# Altium schematic sheet MosfetDrivers.SchDoc
size 420 x 297 mm; Author: Denizhan ALTAY; SheetNumber: 4; SheetTotal: 6
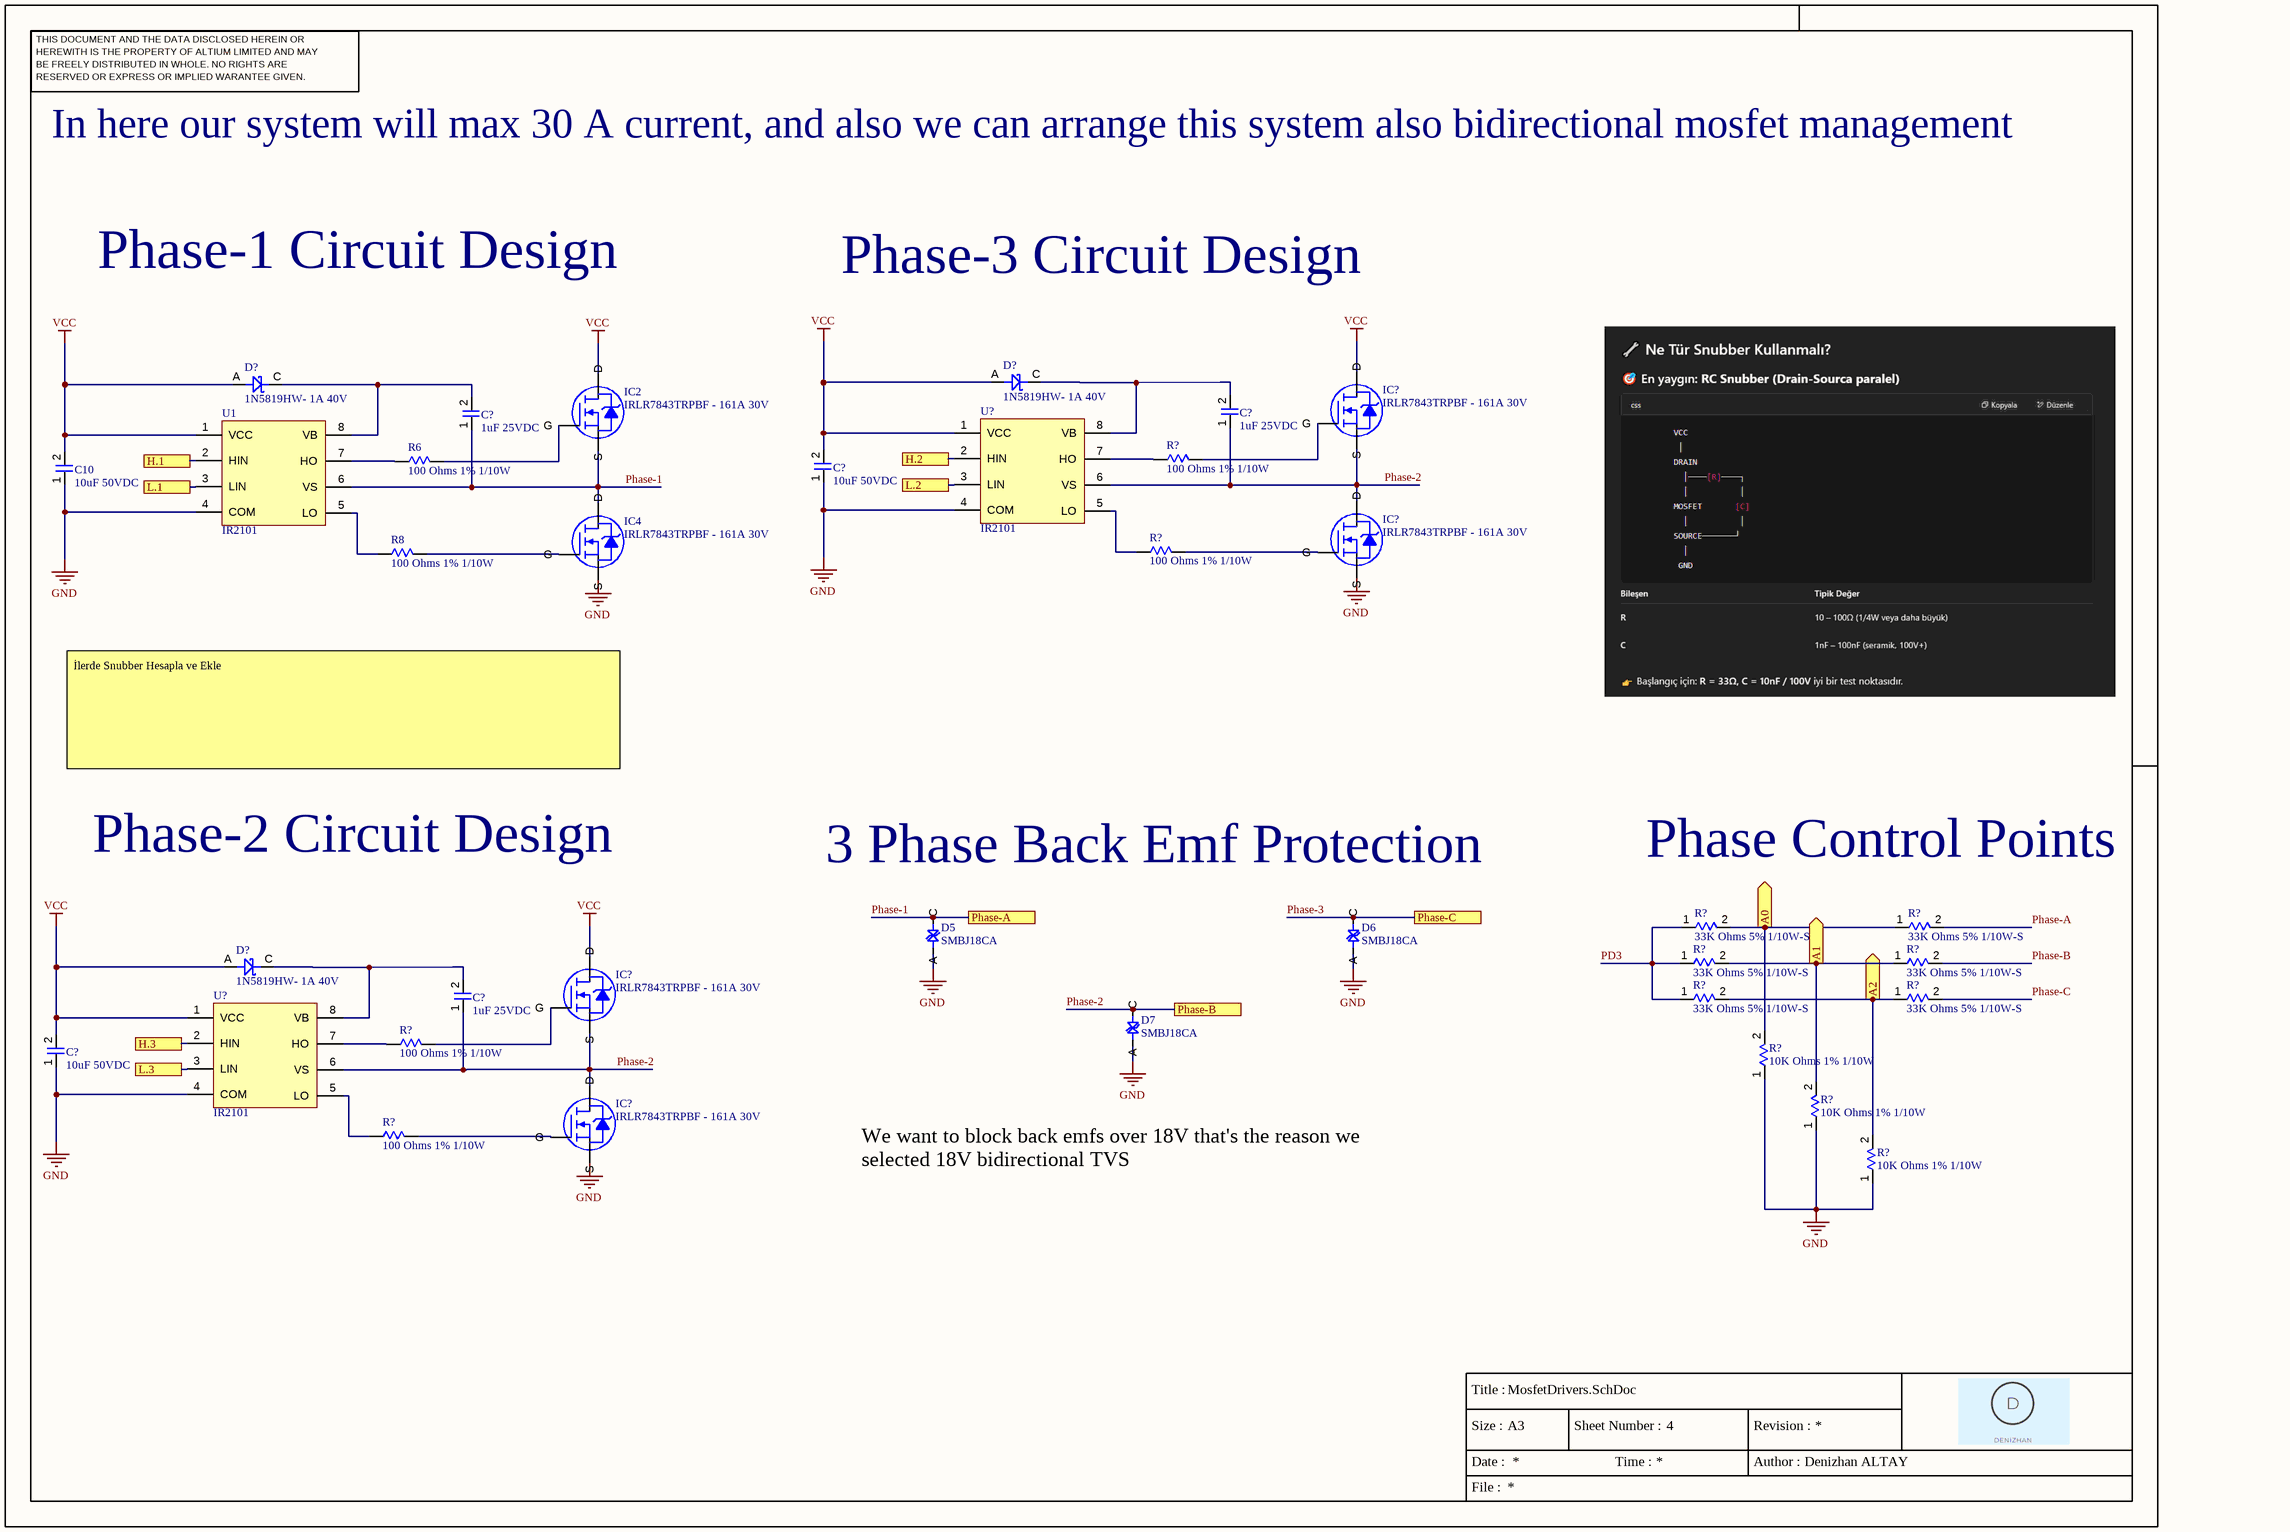
[diagram p0: MosfetDrivers.SchDoc]

## Parts
(Parts that share a designator on the sheet are numbered #1, #2 ... from top to bottom, then left to right.)
C10  10uF 50VDC  [0805_Capacitor_Special_CC0805KKX7R9BB106]
C?#1  1uF 25VDC  [0603_UnP_Capacitor]
C?#2  1uF 25VDC  [0603_UnP_Capacitor]
C?#3  10uF 50VDC  [0805_Capacitor_Special_CC0805KKX7R9BB106]
C?#4  1uF 25VDC  [0603_UnP_Capacitor]
C?#5  10uF 50VDC  [0805_Capacitor_Special_CC0805KKX7R9BB106]
D5  SMBJ18CA  [SMBJ18CA-TKS]
D6  SMBJ18CA  [SMBJ18CA-TKS]
D7  SMBJ18CA  [SMBJ18CA-TKS]
D?#1  1N5819HW- 1A 40V  [1N5819HW-7-F]
D?#2  1N5819HW- 1A 40V  [1N5819HW-7-F]
D?#3  1N5819HW- 1A 40V  [1N5819HW-7-F]
IC2  IRLR7843TRPBF - 161A 30V  [IRLR7843_DPAK229P991X239-3N]
IC4  IRLR7843TRPBF - 161A 30V  [IRLR7843_DPAK229P991X239-3N]
IC?#1  IRLR7843TRPBF - 161A 30V  [IRLR7843_DPAK229P991X239-3N]
IC?#2  IRLR7843TRPBF - 161A 30V  [IRLR7843_DPAK229P991X239-3N]
IC?#3  IRLR7843TRPBF - 161A 30V  [IRLR7843_DPAK229P991X239-3N]
IC?#4  IRLR7843TRPBF - 161A 30V  [IRLR7843_DPAK229P991X239-3N]
R6  100 Ohms 1% 1/10W  [0603_Resistor_Case]
R8  100 Ohms 1% 1/10W  [0603_Resistor_Case]
R?#1  100 Ohms 1% 1/10W  [0603_Resistor_Case]
R?#2  100 Ohms 1% 1/10W  [0603_Resistor_Case]
R?#3  33K Ohms 5% 1/10W-S  [0603_Resistor_Case]
R?#4  33K Ohms 5% 1/10W-S  [0603_Resistor_Case]
R?#5  33K Ohms 5% 1/10W-S  [0603_Resistor_Case]
R?#6  33K Ohms 5% 1/10W-S  [0603_Resistor_Case]
R?#7  33K Ohms 5% 1/10W-S  [0603_Resistor_Case]
R?#8  33K Ohms 5% 1/10W-S  [0603_Resistor_Case]
R?#9  100 Ohms 1% 1/10W  [0603_Resistor_Case]
R?#10  10K Ohms 1% 1/10W  [0603_Resistor_Case]
R?#11  10K Ohms 1% 1/10W  [0603_Resistor_Case]
R?#12  100 Ohms 1% 1/10W  [0603_Resistor_Case]
R?#13  10K Ohms 1% 1/10W  [0603_Resistor_Case]
U1  IR2101  [IR2101_SOIC127P600X175-8N]
U?#1  IR2101  [IR2101_SOIC127P600X175-8N]
U?#2  IR2101  [IR2101_SOIC127P600X175-8N]

## Ports
A0 (out), A1 (out), A2 (out), H.1, H.2, H.3, L.1, L.2, L.3, Phase-A, Phase-B, Phase-C

## Nets
GND: C10.1 C?#3.1 C?#5.1 D5.2(A) D6.2(A) D7.2(A) IC4.3(S) IC?#2.3(S) IC?#4.3(S) R?#10.1 R?#11.1 R?#13.1 U1.4(COM) U?#1.4(COM) U?#2.4(COM)
VCC: C10.2 C?#3.2 C?#5.2 D?#1.A D?#2.A D?#3.A IC2.4(D) IC?#1.4(D) IC?#3.4(D) U1.1(VCC) U?#1.1(VCC) U?#2.1(VCC)
A0: R?#3.2 R?#4.1 R?#10.2 ; port A0
A1: R?#5.2 R?#6.1 R?#11.2 ; port A1
A2: R?#7.2 R?#8.1 R?#13.2 ; port A2
H.1: U1.2(HIN) ; port H.1
H.2: U?#1.2(HIN) ; port H.2
H.3: U?#2.2(HIN) ; port H.3
L.1: U1.3(LIN) ; port L.1
L.2: U?#1.3(LIN) ; port L.2
L.3: U?#2.3(LIN) ; port L.3
PD3: R?#3.1 R?#5.1 R?#7.1
Phase-1: C?#1.1 D5.1(C) IC2.3(S) IC4.4(D) U1.6(VS) ; port Phase-A
Phase-2: C?#2.1 C?#4.1 D7.1(C) IC?#1.3(S) IC?#2.4(D) IC?#3.3(S) IC?#4.4(D) U?#1.6(VS) U?#2.6(VS) ; port Phase-B
Phase-3: D6.1(C) ; port Phase-C
Phase-A: R?#4.2
Phase-B: R?#6.2
Phase-C: R?#8.2
NetC?#1_2: C?#1.2 D?#1.C U1.8(VB)
NetC?#2_2: C?#2.2 D?#2.C U?#1.8(VB)
NetC?#4_2: C?#4.2 D?#3.C U?#2.8(VB)
NetIC2_1: IC2.1(G) R6.2
NetIC4_1: IC4.1(G) R8.2
NetIC?#1_1: IC?#1.1(G) R?#1.2
NetIC?#2_1: IC?#2.1(G) R?#2.2
NetIC?#3_1: IC?#3.1(G) R?#9.2
NetIC?#4_1: IC?#4.1(G) R?#12.2
NetR6_1: R6.1 U1.7(HO)
NetR8_1: R8.1 U1.5(LO)
NetR?#1_1: R?#1.1 U?#1.7(HO)
NetR?#2_1: R?#2.1 U?#1.5(LO)
NetR?#9_1: R?#9.1 U?#2.7(HO)
NetR?#12_1: R?#12.1 U?#2.5(LO)

## Notes on the sheet
- In here our system will max 30 A current, and also we can arrange this system also bidirectional mosfet management
- Phase-1 Circuit Design
- Phase-3 Circuit Design
- İlerde Snubber Hesapla ve Ekle
- Phase-2 Circuit Design
- 3 Phase Back Emf Protection
- Phase Control Points
- We want to block back emfs over 18V that's the reason we selected 18V bidirectional TVS
- THIS DOCUMENT AND THE DATA DISCLOSED HEREIN OR
- HEREWITH IS THE PROPERTY OF ALTIUM LIMITED AND MAY
- BE FREELY DISTRIBUTED IN WHOLE. NO RIGHTS ARE
- RESERVED OR EXPRESS OR IMPLIED WARANTEE GIVEN.
- Title :
- Size :
- Date :
- A3
- Sheet Number :
- Time :
- Revision :
- Author :
- File :

## Library data of the parts
C10 C?#3 C?#5 = CC0805KKX7R9BB106 - MLCC 0805 10uF 50VDC ±10% X7R: Manufacturer: YAGEO; Capacitor Type: Unpolarized; Library Ref: Capacitors; Package / Case: 0805; Capacitor Value: 10uF; Part Number: CC0805KKX7R9BB106; ComponentLink1Description: New link; ComponentLink1URL: https://www.ozdisan.com/passive-components/capacitors/smt-smd-and-mlcc-capacitors/CL10B392KB8NNNC/26336; Max Working Voltage: 50VDC
C?#1 C?#2 C?#4 = MCF03KTB250105 - MLCC (1608) 0603 1uF 25VDC ±10% X7R: Manufacturer: VIKING; Part Number: MCF03MTX250106; Capacitor Type: Ceramic; Max Working Voltage: 25V; Capacitance: 1µF; Case/Size Code: 0603; Library Ref: Capacitors; ComponentLink1Description: New link; ComponentLink1URL: https://www.ozdisan.com/passive-components/resistors/smt-smd-and-chip-resistors/PS03W4F1003T5E/592727; Availability: Available; Package: SMD
D5-D7 = SMBJ18CA-TKS - DIODE TVS 600W 18V DO214AA: SMBJ18CA-TKS - DIODE TVS 600W 18V DO214AA (SMB) SMT; MF: THINKING ELECTRONIC; Diode Direction: Bidirectional; Package: SMD; Price: None; Library Ref: Diodes; MP: SMBJ18CA-TKS; Availability: Available; Type: TVS
D?#1-D?#3 = 1N5819HW-7-F: Diode Schottky 40 V 1A Surface Mount SOD-123; Diode Types: Switching; Working Voltage (Max): 4; Library Ref: Diodes; Availability: Available; Package: SMD; Rated Current (Max): 1A; Type: Schottky
IC2 IC4 IC?#1-IC?#4 = IRLR7843TRPBF - MOSFET DIS.161A 30V N-CH TO252(DPAK) HEXFET SMT: Mosfet Type: N; Library Ref: Mosfets; Package / Case: D-Pack
R6 R8 R?#1 R?#2 R?#9 R?#12 = CQ03SAF1000T5E - 0603 100 Ohms 1% 1/10W AUTOMOTIV: Manufacturer: ROYALOHM; Working Voltage (Max): 75V; Library Ref: Resistors; Package / Case: 0603; Power (Watts): 1/10W; Resistor Value: 100 Ohms; Part Number: CQ03SAF1000T5E; ComponentLink1Description: New link; ComponentLink1URL: https://www.ozdisan.com/passive-components/resistors/smt-smd-and-chip-resistors/PS03W4F1003T5E/592727
R?#3-R?#8 = 0603SAJ0333T5E - RES. 0603 33K Ohms 5% 1/10W-S 100PPM: 0603SAJ0333T5E - RES.(1608) 0603 33K Ohms 5% 1/10W-S 100PPM; Manufacturer: ROYALOHM; Power (Watts): 1/10W; Working Voltage (Max): 75V; Library Ref: Resistors; Package / Case: 0603; Resistor Value: 33K Ohms; Part Number: 0603SAJ0333T5E; ComponentLink1Description: New link; ComponentLink1URL: https://www.ozdisan.com/passive-components/resistors/smt-smd-and-chip-resistors/PS03W4F1003T5E/592727
R?#10 R?#11 R?#13 = RC0603FR-0710KL - 0603 10K Ohms 1% 1/10W 100PPM: Manufacturer: HOTTECH; Part Number: PS03W4F1003T5E; Max Working Voltage: 75V; Library Ref: Resistors; Package / Case: 0603; Power (Watts): 1/10W; Resistor Value: 10K Ohms; ComponentLink1Description: New link; ComponentLink1URL: https://www.ozdisan.com/passive-components/resistors/smt-smd-and-chip-resistors/PS03W4F1003T5E/592727
U1 U?#1 U?#2 = IR2101: High Speed power MOSFET and IGBT driver; Library Ref: Mosfet Controllers